# Altium schematic sheet collection.SchDoc
size A2
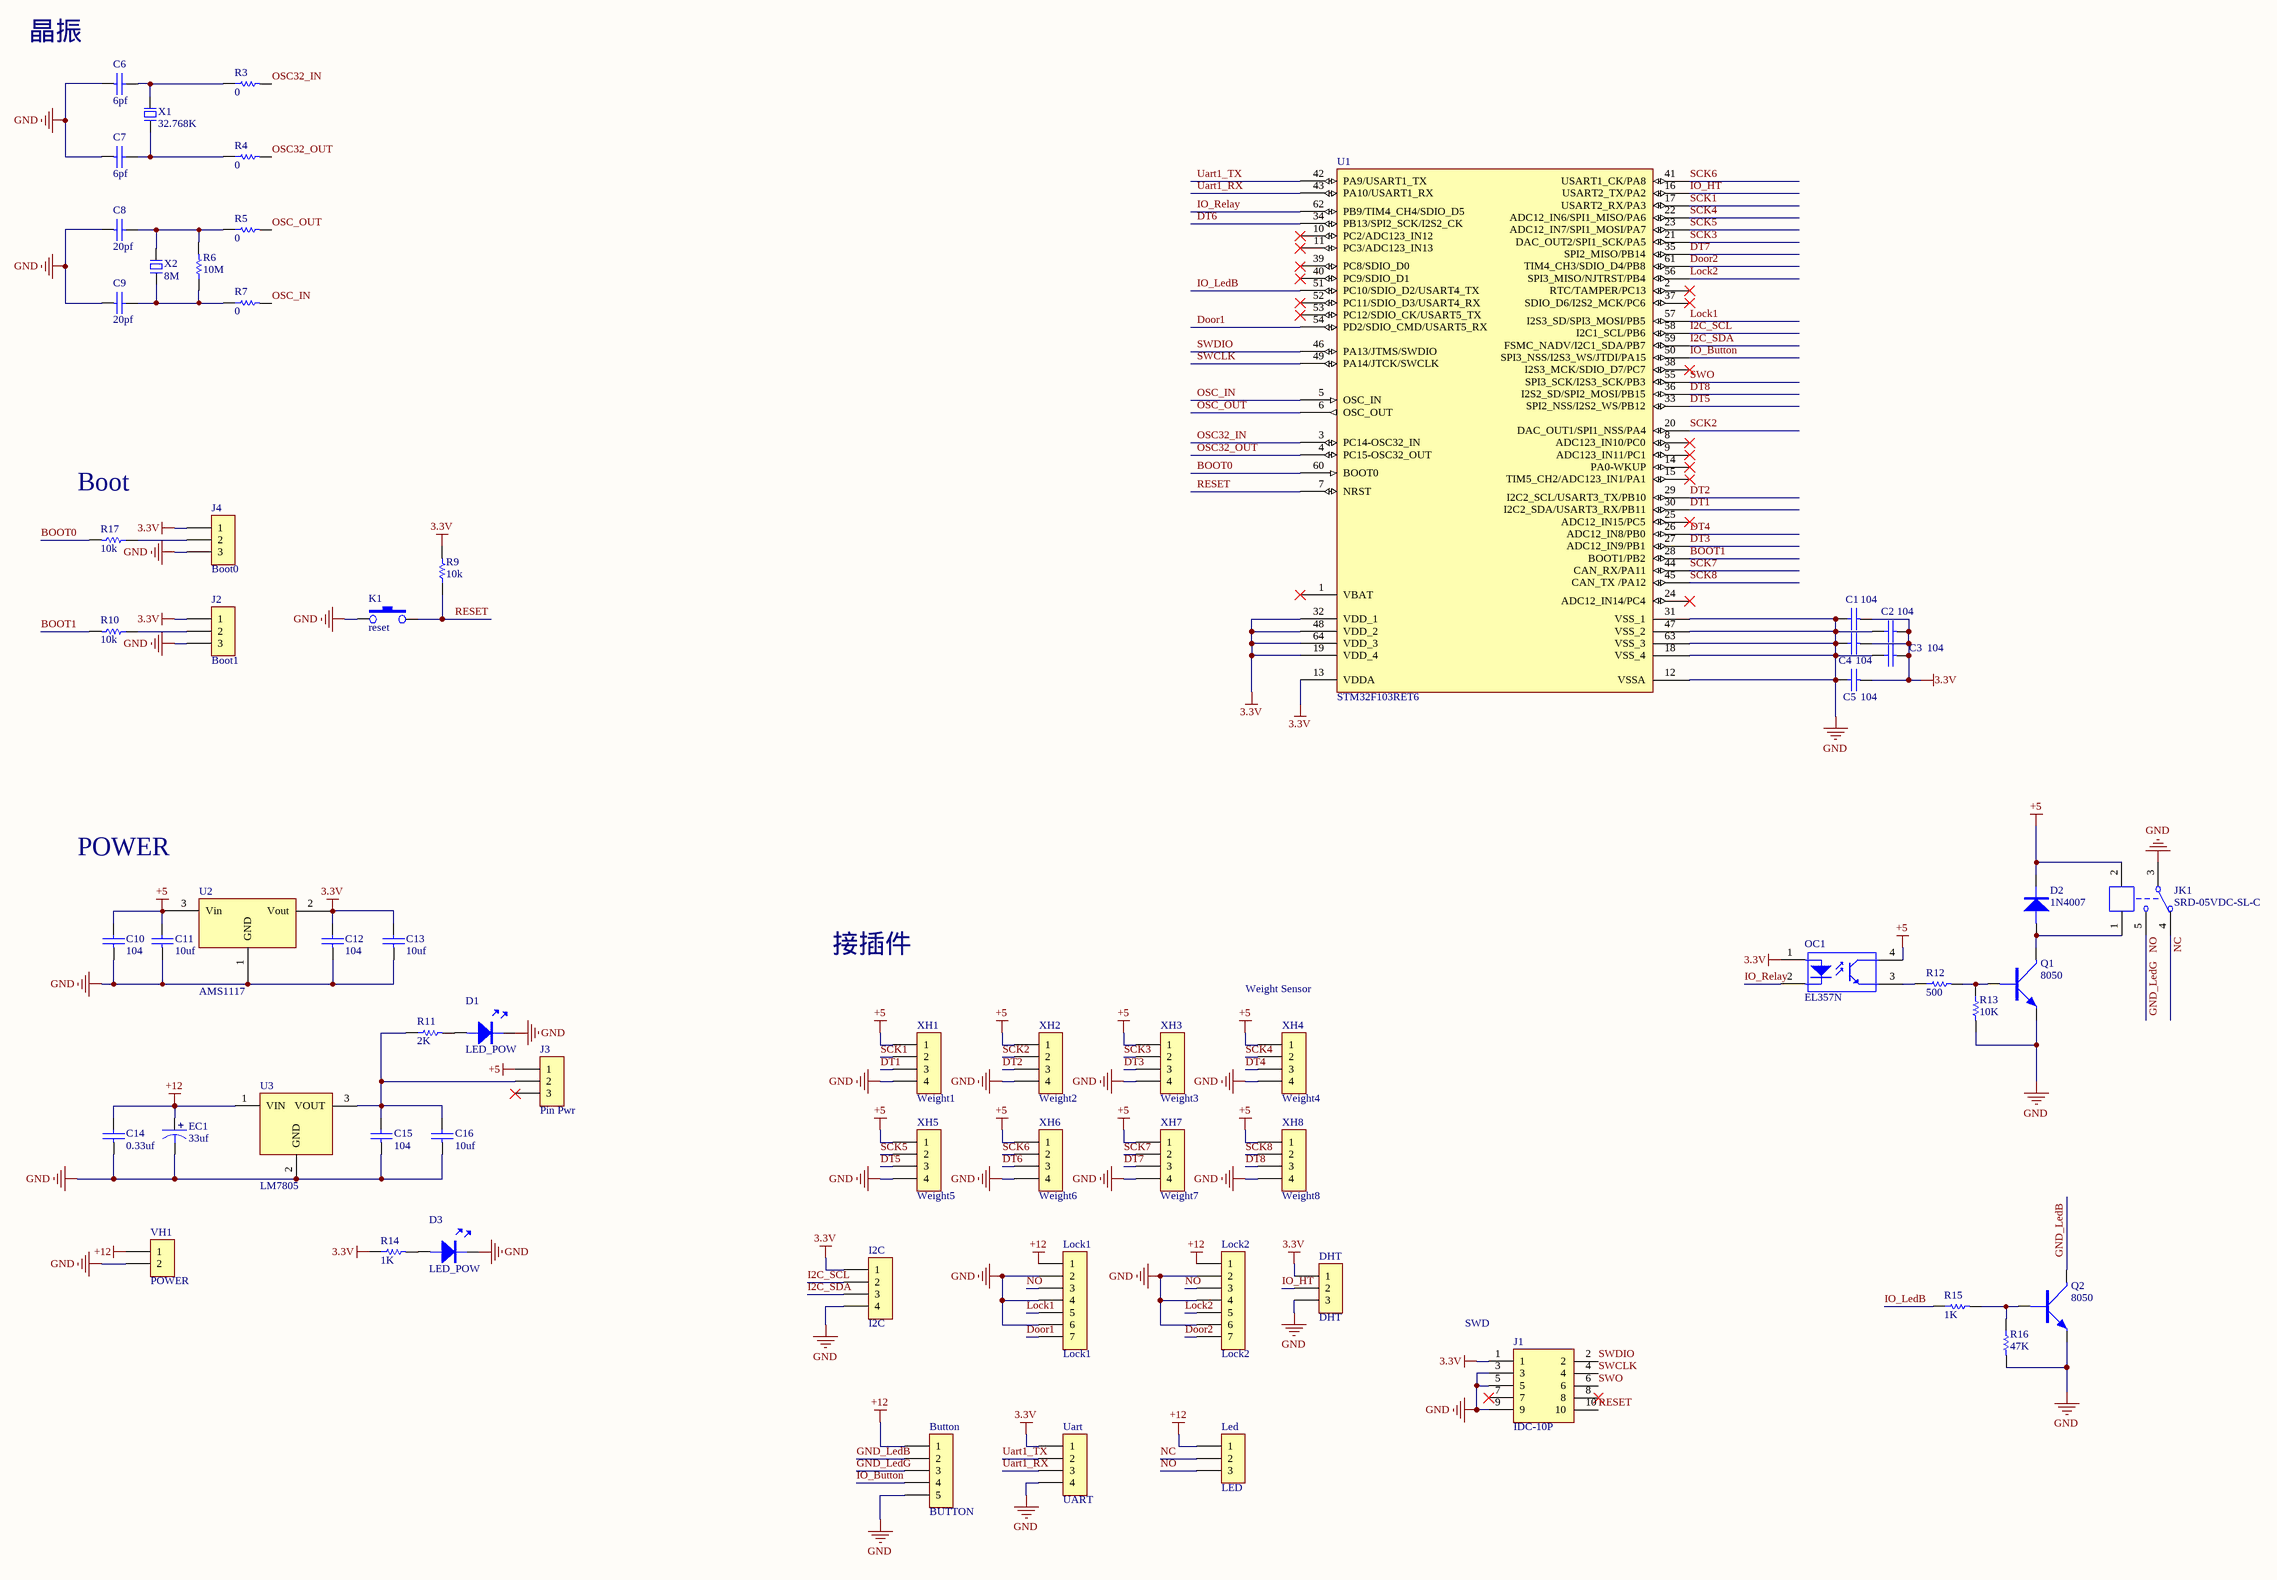
[diagram p0: collection.SchDoc]

## Parts
Button  BUTTON  [XH5/2.54mm/90]
C1  104  [0603C]
C2  104  [0603C]
C3  104  [0603C]
C4  104  [0603C]
C5  104  [0603C]
C6  6pf  [0603C]
C7  6pf  [0603C]
C8  20pf  [0603C]
C9  20pf  [0603C]
C10  104  [0805C]
C11  10uf  [0805C]
C12  104  [0805C]
C13  10uf  [0805C]
C14  0.33uf  [0805C]
C15  104  [0805C]
C16  10uf  [0805C]
D1  LED_POW  [LED-0805R]
D2  1N4007  [SOD-123]
D3  LED_POW  [LED-0805G]
DHT  DHT  [XH3/2.54mm/180]
EC1  33uf  [SMD-EC6.3X6.3X10]
I2C  I2C  [XH4/2.54mm/180]
J1  IDC-10P  [IDC2.54-10P]
J2  Boot1  [Pin HDR1X3/2.54mm-S]
J3  Pin Pwr  [Pin HDR1X3/2.54mm-S]
J4  Boot0  [Pin HDR1X3/2.54mm-S]
JK1  SRD-05VDC-SL-C  [SRD-C_B]
K1  reset  [SMD-3X6X2.5]
Led  LED  [XH3/2.54mm/90]
Lock1  Lock1  [XH7/2.54mm/90]
Lock2  Lock2  [XH7/2.54mm/90]
OC1  EL357N  [SMD_EL357N]
Q1  8050  [SOT-23]
Q2  8050  [SOT-23]
R3  0  [0603R]
R4  0  [0603R]
R5  0  [0603R]
R6  10M  [0805R]
R7  0  [0603R]
R9  10k  [0805R]
R10  10k  [0805R]
R11  2K  [0805R]
R12  500  [0805R]
R13  10K  [0805R]
R14  1K  [0805R]
R15  1K  [0805R]
R16  47K  [0805R]
R17  10k  [0805R]
U1  STM32F103RET6  [LQFP64 10x10]
U2  AMS1117  [SOT223]
U3  LM7805  [TO252]
Uart  UART  [XH4/2.54mm/180]
VH1  POWER  [VH3.96-2AW]
X1  32.768K  [OSC-3x8-WI-B]
X2  8M  [OSC HC-49S]
XH1  Weight1  [XH4/2.54mm/180]
XH2  Weight2  [XH4/2.54mm/180]
XH3  Weight3  [XH4/2.54mm/180]
XH4  Weight4  [XH4/2.54mm/180]
XH5  Weight5  [XH4/2.54mm/180]
XH6  Weight6  [XH4/2.54mm/180]
XH7  Weight7  [XH4/2.54mm/180]
XH8  Weight8  [XH4/2.54mm/180]

## Nets
3.3V: C1.1 C2.1 C3.1 C4.1 C5.1 C12.2 C13.2 DHT.1 I2C.1 J1.1 J2.1 J4.1 OC1.1(A) R9.2 R14.1 U1.13(VDDA) U1.19(VDD_4) U1.32(VDD_1) U1.48(VDD_2) U1.64(VDD_3) U2.2(Vout) Uart.1
+5: C10.2 C11.2 D2.K J3.1 JK1.2 OC1.4(C) U2.3(Vin) XH1.1 XH2.1 XH3.1 XH4.1 XH5.1 XH6.1 XH7.1 XH8.1
+12: Button.1 C14.2 EC1.1 Led.1 Lock1.1 Lock2.1 U3.1(VIN) VH1.1
GND: Button.5 C1.2 C2.2 C3.2 C4.2 C5.2 C6.1 C7.1 C8.1 C9.1 C10.1 C11.1 C12.1 C13.1 C14.1 C15.1 C16.1 D1.K D3.K DHT.3 EC1.2 I2C.4 J1.3 J1.5 J1.9 J2.3 J4.3 JK1.3 K1.1 Lock1.2 Lock1.4 Lock1.6 Lock2.2 Lock2.4 Lock2.6 Q1.E Q2.E R13.2 R16.2 U1.12(VSSA) U1.18(VSS_4) U1.31(VSS_1) U1.47(VSS_2) U1.63(VSS_3) U2.1(GND) U3.2(GND) Uart.4 VH1.2 XH1.4 XH2.4 XH3.4 XH4.4 XH5.4 XH6.4 XH7.4 XH8.4
BOOT0: R17.2 U1.60(BOOT0)
BOOT1: R10.2 U1.28(BOOT1/PB2)
Door1: Lock1.7 U1.54(PD2/SDIO_CMD/USART5_RX)
Door2: Lock2.7 U1.61(TIM4_CH3/SDIO_D4/PB8)
DT1: U1.30(I2C2_SDA/USART3_RX/PB11) XH1.3
DT2: U1.29(I2C2_SCL/USART3_TX/PB10) XH2.3
DT3: U1.27(ADC12_IN9/PB1) XH3.3
DT4: U1.26(ADC12_IN8/PB0) XH4.3
DT5: U1.33(SPI2_NSS/I2S2_WS/PB12) XH5.3
DT6: U1.34(PB13/SPI2_SCK/I2S2_CK) XH6.3
DT7: U1.35(SPI2_MISO/PB14) XH7.3
DT8: U1.36(I2S2_SD/SPI2_MOSI/PB15) XH8.3
GND_LedB: Button.2 Q2.C
GND_LedG: Button.3 JK1.5 Led.3 Lock1.3 Lock2.3  [also labelled NO]
I2C_SCL: I2C.2 U1.58(I2C1_SCL/PB6)
I2C_SDA: I2C.3 U1.59(FSMC_NADV/I2C1_SDA/PB7)
IO_Button: Button.4 U1.50(SPI3_NSS/I2S3_WS/JTDI/PA15)
IO_HT: DHT.2 U1.16(USART2_TX/PA2)
IO_LedB: R15.1 U1.51(PC10/SDIO_D2/USART4_TX)
IO_Relay: OC1.2(K) U1.62(PB9/TIM4_CH4/SDIO_D5)
Lock1: Lock1.5 U1.57(I2S3_SD/SPI3_MOSI/PB5)
Lock2: Lock2.5 U1.56(SPI3_MISO/NJTRST/PB4)
NC: JK1.4 Led.2
OSC32_IN: R3.2 U1.3(PC14-OSC32_IN)
OSC32_OUT: R4.2 U1.4(PC15-OSC32_OUT)
OSC_IN: R7.2 U1.5(OSC_IN)
OSC_OUT: R5.2 U1.6(OSC_OUT)
RESET: J1.10 K1.3 R9.1 U1.7(NRST)
SCK1: U1.17(USART2_RX/PA3) XH1.2
SCK2: U1.20(DAC_OUT1/SPI1_NSS/PA4) XH2.2
SCK3: U1.21(DAC_OUT2/SPI1_SCK/PA5) XH3.2
SCK4: U1.22(ADC12_IN6/SPI1_MISO/PA6) XH4.2
SCK5: U1.23(ADC12_IN7/SPI1_MOSI/PA7) XH5.2
SCK6: U1.41(USART1_CK/PA8) XH6.2
SCK7: U1.44(CAN_RX/PA11) XH7.2
SCK8: U1.45(CAN_TX_/PA12) XH8.2
SWCLK: J1.4 U1.49(PA14/JTCK/SWCLK)
SWDIO: J1.2 U1.46(PA13/JTMS/SWDIO)
SWO: J1.6 U1.55(SPI3_SCK/I2S3_SCK/PB3)
Uart1_RX: U1.43(PA10/USART1_RX) Uart.3
Uart1_TX: U1.42(PA9/USART1_TX) Uart.2
NetC6_2: C6.2 R3.1 X1.2
NetC7_2: C7.2 R4.1 X1.1
NetC8_2: C8.2 R5.1 R6.2 X2.2
NetC9_2: C9.2 R6.1 R7.1 X2.1
NetC15_2: C15.2 C16.2 J3.2 R11.1 U3.3(VOUT)
NetD1_A: D1.A R11.2
NetD2_A: D2.A JK1.1 Q1.C
NetD3_A: D3.A R14.2
NetJ2_2: J2.2 R10.1
NetJ4_2: J4.2 R17.1
NetOC1_3: OC1.3(E) R12.1
NetQ1_B: Q1.B R12.2 R13.1
NetQ2_B: Q2.B R15.2 R16.1

Not connected (* = marked no-connect by the designer): J1 7* 8*; J3 3*; U1 1(VBAT)* 2(RTC/TAMPER/PC13)* 8(ADC123_IN10/PC0)* 9(ADC123_IN11/PC1)* 10(PC2/ADC123_IN12)* 11(PC3/ADC123_IN13)* 14(PA0-WKUP)* 15(TIM5_CH2/ADC123_IN1/PA1)* 24(ADC12_IN14/PC4)* 25(ADC12_IN15/PC5)* 37(SDIO_D6/I2S2_MCK/PC6)* 38(I2S3_MCK/SDIO_D7/PC7)* 39(PC8/SDIO_D0)* 40(PC9/SDIO_D1)* 52(PC11/SDIO_D3/USART4_RX)* 53(PC12/SDIO_CK/USART5_TX)*

## Notes on the sheet
- 晶振
- (near R17) Boot
- POWER
- 接插件
- Weight Sensor
- (near J1) SWD

## Library data of the parts
Button = XH5
C1-C16 = CAP: 无极性电容
D1 D3 = LED
D2 = DIODE: 普通二极管
DHT Led = XH3
EC1 = SMD_ECAP: 贴片电解电容
I2C Uart XH1-XH8 = XH4
J2-J4 = Pin HDR1X3
JK1 = SRD-05VDC-SL-C: 5V一组转换
K1 = KEY
Lock1 Lock2 = XH7
OC1 = EL357N: 线性光耦
Q1 Q2 = NPN: NPN三极管
R3-R7 R9-R17 = RES
U2 = AMS1117: 三端稳压芯片
VH1 = VH2
X1 X2 = XTAL-2P: 2脚无源脚晶振